# Altium project PCB_LSH-120.PRJPCB
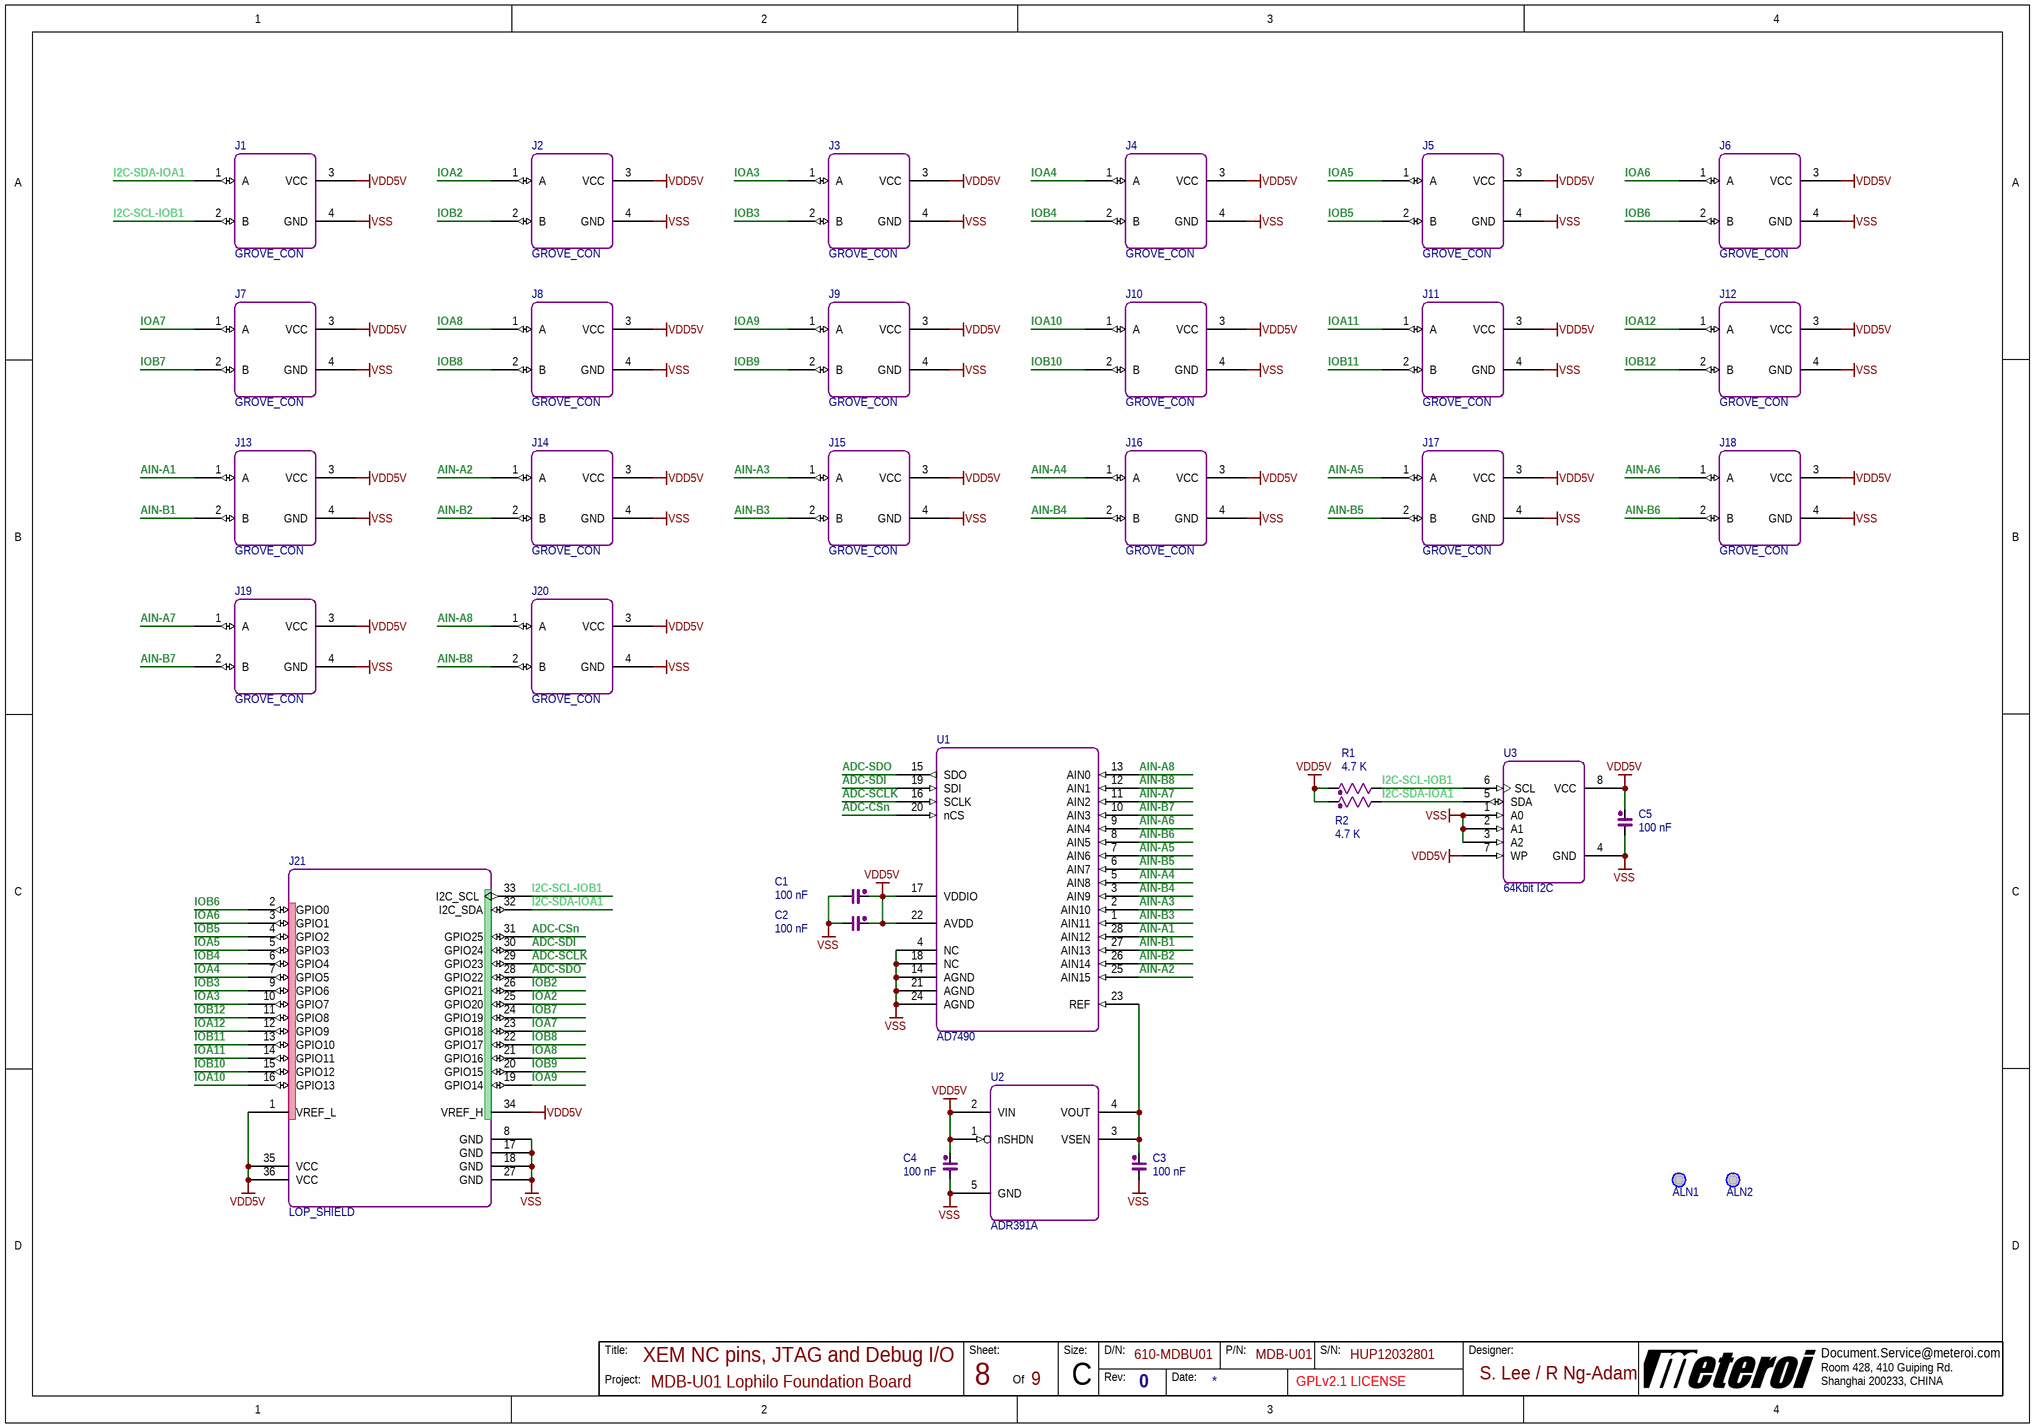
[diagram p0: 01_LSH-120.SchDoc]
ClassifiedLevel: GPLv2.1 LICENSE; Designer: S. Lee / R Ng-Adam; DocumentSerialNumber: 610-MDBU01; Email: Document.Service@meteroi.com; PartNumber: MDB-U01; PrjRevision: 0; SerialNumber: HUP12032801; SheetTotalNumber: 9; TopProjectName: MDB-U01 Lophilo Foundation Board
1 sheet, 33 parts. Net scope: global (net labels, ports and power ports of the same name join across sheets).
Board file: PCB_LSH-120.PcbDoc

## Sheet 01_LSH-120.SchDoc: XEM NC pins, JTAG and Debug I/O
size 381 x 266 mm; Organization: Meteroi; Address1: Room 428, 410 Guiping Rd.; Address2: Shanghai 200233, CHINA; SheetNumber: 8; SheetTotal: 9; PageSetup: Record=PageOptions|CenterHorizontal=True|CenterVertical=True|PrintScale=0.75|XCorrection=1.00|YCorrection=1.00|PrintKind=2|BorderSize=5000000|LeftOffset=0|BottomOffset=0|Orientation=2|PaperLength=1000|PaperWidth=1000|Scale=100|PaperSource=276|PrintQuality=-3|MediaType=1|DitherType=10|PaperKind=A4|PrintScaleMode=1

### Parts
ALN1  Assembly Optical Align  [ALIGN_1]  (value not drawn)
ALN2  Assembly Optical Align  [ALIGN_1]  (value not drawn)
C1  100 nF  [0603A1]
C2  100 nF  [0603A1]
C3  100 nF  [0603A1]
C4  100 nF  [0603A1]
C5  100 nF  [0603A1]
J1  GROVE_CON  [PHB-4A]
J2  GROVE_CON  [PHB-4A]
J3  GROVE_CON  [PHB-4A]
J4  GROVE_CON  [PHB-4A]
J5  GROVE_CON  [PHB-4A]
J6  GROVE_CON  [PHB-4A]
J7  GROVE_CON  [PHB-4A]
J8  GROVE_CON  [PHB-4A]
J9  GROVE_CON  [PHB-4A]
J10  GROVE_CON  [PHB-4A]
J11  GROVE_CON  [PHB-4A]
J12  GROVE_CON  [PHB-4A]
J13  GROVE_CON  [PHB-4A]
J14  GROVE_CON  [PHB-4A]
J15  GROVE_CON  [PHB-4A]
J16  GROVE_CON  [PHB-4A]
J17  GROVE_CON  [PHB-4A]
J18  GROVE_CON  [PHB-4A]
J19  GROVE_CON  [PHB-4A]
J20  GROVE_CON  [PHB-4A]
J21  LOP_SHIELD  [LOP_SHIELD_MOD]
R1  4.7 K  [0603A2]
R2  4.7 K  [0603A2]
U1  AD7490  [TSSOP-28]
U2  ADR391A  [SOT-23-5]
U3  64Kbit I2C  [SOIC-8S]

### Nets
VDD5V: C1.2 C2.2 C4.2 C5.2 J1.3(VCC) J2.3(VCC) J3.3(VCC) J4.3(VCC) J5.3(VCC) J6.3(VCC) J7.3(VCC) J8.3(VCC) J9.3(VCC) J10.3(VCC) J11.3(VCC) J12.3(VCC) J13.3(VCC) J14.3(VCC) J15.3(VCC) J16.3(VCC) J17.3(VCC) J18.3(VCC) J19.3(VCC) J20.3(VCC) J21.1(VREF_L) J21.34(VREF_H) J21.35(VCC) J21.36(VCC) R1.2 R2.2 U1.17(VDDIO) U1.22(AVDD) U2.1(nSHDN) U2.2(VIN) U3.7(WP) U3.8(VCC)
VSS: C1.1 C2.1 C3.1 C4.1 C5.1 J1.4(GND) J2.4(GND) J3.4(GND) J4.4(GND) J5.4(GND) J6.4(GND) J7.4(GND) J8.4(GND) J9.4(GND) J10.4(GND) J11.4(GND) J12.4(GND) J13.4(GND) J14.4(GND) J15.4(GND) J16.4(GND) J17.4(GND) J18.4(GND) J19.4(GND) J20.4(GND) J21.8(GND) J21.17(GND) J21.18(GND) J21.27(GND) U1.4(NC) U1.14(AGND) U1.18(NC) U1.21(AGND) U1.24(AGND) U2.5(GND) U3.1(A0) U3.2(A1) U3.3(A2) U3.4(GND)
ADC-CSn: J21.31(GPIO25) U1.20(nCS)
ADC-SCLK: J21.29(GPIO23) U1.16(SCLK)
ADC-SDI: J21.30(GPIO24) U1.19(SDI)
ADC-SDO: J21.28(GPIO22) U1.15(SDO)
AIN-A1: J13.1(A) U1.28(AIN12)
AIN-A2: J14.1(A) U1.25(AIN15)
AIN-A3: J15.1(A) U1.2(AIN10)
AIN-A4: J16.1(A) U1.5(AIN8)
AIN-A5: J17.1(A) U1.7(AIN6)
AIN-A6: J18.1(A) U1.9(AIN4)
AIN-A7: J19.1(A) U1.11(AIN2)
AIN-A8: J20.1(A) U1.13(AIN0)
AIN-B1: J13.2(B) U1.27(AIN13)
AIN-B2: J14.2(B) U1.26(AIN14)
AIN-B3: J15.2(B) U1.1(AIN11)
AIN-B4: J16.2(B) U1.3(AIN9)
AIN-B5: J17.2(B) U1.6(AIN7)
AIN-B6: J18.2(B) U1.8(AIN5)
AIN-B7: J19.2(B) U1.10(AIN3)
AIN-B8: J20.2(B) U1.12(AIN1)
I2C-SCL-IOB1: J1.2(B) J21.33(I2C_SCL) R1.1 U3.6(SCL)
I2C-SDA-IOA1: J1.1(A) J21.32(I2C_SDA) R2.1 U3.5(SDA)
IOA2: J2.1(A) J21.25(GPIO20)
IOA3: J3.1(A) J21.10(GPIO7)
IOA4: J4.1(A) J21.7(GPIO5)
IOA5: J5.1(A) J21.5(GPIO3)
IOA6: J6.1(A) J21.3(GPIO1)
IOA7: J7.1(A) J21.23(GPIO18)
IOA8: J8.1(A) J21.21(GPIO16)
IOA9: J9.1(A) J21.19(GPIO14)
IOA10: J10.1(A) J21.16(GPIO13)
IOA11: J11.1(A) J21.14(GPIO11)
IOA12: J12.1(A) J21.12(GPIO9)
IOB2: J2.2(B) J21.26(GPIO21)
IOB3: J3.2(B) J21.9(GPIO6)
IOB4: J4.2(B) J21.6(GPIO4)
IOB5: J5.2(B) J21.4(GPIO2)
IOB6: J6.2(B) J21.2(GPIO0)
IOB7: J7.2(B) J21.24(GPIO19)
IOB8: J8.2(B) J21.22(GPIO17)
IOB9: J9.2(B) J21.20(GPIO15)
IOB10: J10.2(B) J21.15(GPIO12)
IOB11: J11.2(B) J21.13(GPIO10)
IOB12: J12.2(B) J21.11(GPIO8)
NetC3_2: C3.2 U1.23(REF) U2.3(VSEN) U2.4(VOUT)

### Notes on the sheet
- Title:
- Project:
- Sheet:
- Of
- Size:
- D/N:
- Rev:
- Date:
- P/N:
- S/N:
- Designer:
- C

### Library data of the parts
ALN1 ALN2 = ALIGN: Vendor: 0; Designer: shyul; PCBMarker: Aligner; Value: Assembly Optical Align; Version: 1.0; VersionDate: 05-21-2011; SerialNumber: 0; PartNumber: 0; Publisher: Cowin
C1-C5 = CAP: Normal Capacitor; PartNumber: 0; Vendor: muRata; Designer: shyul; PinCountSMD: 2; Value: 100 nF; SerialNumber: 0; Publisher: Cowin; PCBMarker: Capacitor; Version: 1.0; VersionDate: 04-27-2011; PinCountHole: 0
J1-J20 = GROVE_CON: Grove Connector; Vendor: 0; PinCountHole: 4; Designer: shyul; Value: GROVE_CON; PartNumber: GROVE_CON; Version: 1.0; VersionDate: 04-04-2012; PinCountSMD: 0; SerialNumber: 0; Publisher: Cowin; PCBMarker: GROVE_CON
J21 = LOP_SHIELD_MOD: Lophilo Shield Module Slot; Vendor: 0; PinCountHole: 36; Designer: shyul; Value: LOP_SHIELD; PartNumber: LOP_SHIELD; Version: 1.0; VersionDate: 03-19-2012; PinCountSMD: 0; SerialNumber: 0; Publisher: Cowin; PCBMarker: LOP_SHIELD
R1 R2 = RES: Normal Resistor; PartNumber: 0; Vendor: KOA; Designer: shyul; PinCountSMD: 2; SerialNumber: 0; Value: 4.7 K; Version: 1.0; VersionDate: 04-27-2011; PCBMarker: Resistor; Publisher: Cowin; PinCountHole: 0
U1 = AD7490: 16 Inputs MUX ADC / 12-Bit 1Msps; Vendor: ADI; SerialNumber: 0; PinCountSMD: 28; Designer: shyul; PartNumber: AD7490; Value: AD7490; Version: 1.0; VersionDate: 04-04-2012; PCBMarker: ADC; Publisher: Cowin; PinCountHole: 0
U2 = ADR391: 16 Inputs MUX ADC / 12-Bit 1Msps; PartNumber: ADR391AUJZ; Vendor: TI; SerialNumber: 0; PinCountSMD: 37; Designer: shyul; Value: ADR391A; Version: 1.0; VersionDate: 04-04-2012; PCBMarker: ADC; Publisher: Cowin; PinCountHole: 0
U3 = ROM_I2C_A: Generic 24 Series I2C ROM; PartNumber: 24C08; Vendor: Microchip; SerialNumber: 0; PCBMarker: I2C ROM; PinCountSMD: 8; Designer: shyul; Value: 64Kbit I2C; Version: 1.0; VersionDate: 05-08-2011; Publisher: Cowin; PinCountHole: 0; Supplier 1: Digi-Key; Supplier Part Number 1: 24LC64T-I/SNTR-ND